# EAGLE design datalogger-v21 (EAGLE 8.0.1)
DATABASE: /Users/kina/Documents/eagle/PARTSDB.txt

## Sheet 1 of 2
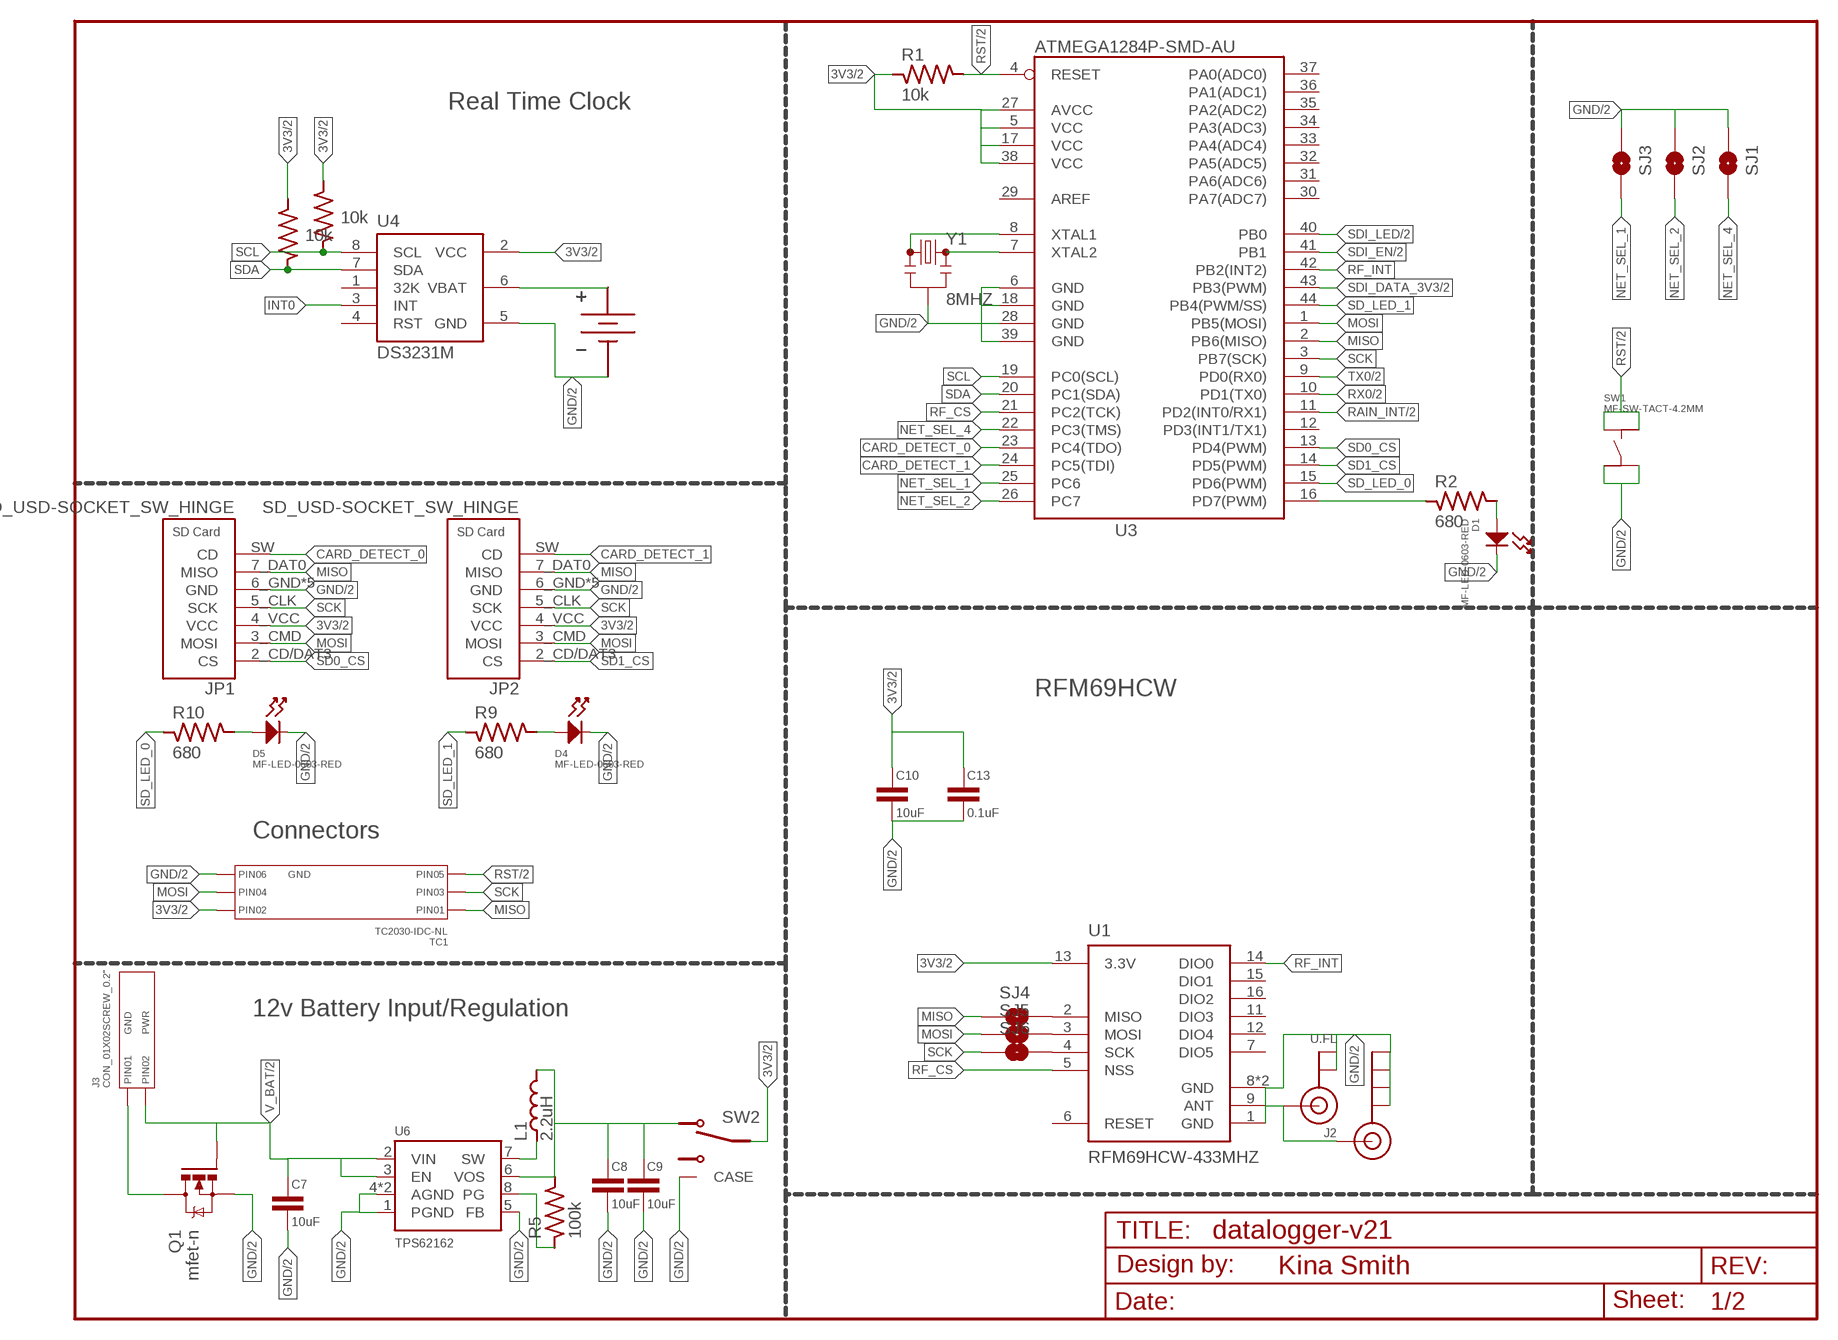
[diagram p0: schematic, sheet 1]

### Parts
BAT1  BATTERY_HOLDER12MM  [BAT_12MM]
C7  10uF  CAPACITOR_NP0805-N  [C0805-N]
C8  10uF  CAPACITOR_NP0805-N  [C0805-N]
C9  10uF  CAPACITOR_NP0805-N  [C0805-N]
C10  10uF  CAPACITOR_NP0805-N  [C0805-N]
C13  0.1uF  CAPACITOR_NP0603-N  [C0603-N]
D1  MF-LED-0603-RED  LED_SINGLE-0603-RED  [LED0603]
D4  MF-LED-0603-RED  LED_SINGLE-0603-RED  [LED0603]
D5  MF-LED-0603-RED  LED_SINGLE-0603-RED  [LED0603]
FRAME1  FRAME-LETTERNO_PACKAGE  [DUMMY]
J2  U.FL  ANTENNA_U.FL  [ADAFRUIT_U.FL]
J3  CON_01X02SCREW_0.2"  [SCREW_TERM_2POS]
J4  ANTENNA_SMA_EDGE  [SMA-EDGE]
JP1  SD_USD-SOCKET_SW_HINGE  [SD_MICRO_HIROSE-DM3C]
JP2  SD_USD-SOCKET_SW_HINGE  [SD_MICRO_HIROSE-DM3C]
L1  2.2uH  INDUCTOR2520  [L2520]
Q1  mfet-n  MOSFET-NCHANNELSOT23-3  [SOT23-3]
R1  10k  RESISTOR0603-N  [R0603-N]
R2  680  RESISTOR0603-N  [R0603-N]
R3  10k  RESISTOR0603-N  [R0603-N]
R4  10k  RESISTOR0603-N  [R0603-N]
R5  100k  RESISTOR0603-N  [R0603-N]
R9  680  RESISTOR0603-N  [R0603-N]
R10  680  RESISTOR0603-N  [R0603-N]
SJ1  JUMPER-PAD-2-NOYES_SILK  [PAD-JUMPER-2-NO_YES_SILK]
SJ2  JUMPER-PAD-2-NOYES_SILK  [PAD-JUMPER-2-NO_YES_SILK]
SJ3  JUMPER-PAD-2-NOYES_SILK  [PAD-JUMPER-2-NO_YES_SILK]
SJ4  JUMPER-PAD-2-NOYES_SILK  [PAD-JUMPER-2-NO_YES_SILK]
SJ5  JUMPER-PAD-2-NOYES_SILK  [PAD-JUMPER-2-NO_YES_SILK]
SJ6  JUMPER-PAD-2-NOYES_SILK  [PAD-JUMPER-2-NO_YES_SILK]
SW1  MF-SW-TACT-4.2MM  TACT_4.2MM  [TACT4.2MM]
SW2  SWITCH_SPDT_SMD_ES01MSABE  [SPDT_ES01MSABE]
TC1  TC2030-IDC-NL  CON_02X03_AVRISP_TC2030-IDC-NL  [TC2030-IDC-NL]
U1  RFM69HCW-433MHZ  [RFM69HCW-XXXS2]
U3  ATMEGA1284P-SMD-AU  [TQFP44]
U4  DS3231M  [SO08]
U6  TPS62162  [WSON-8]
Y1  8MHZ  RESONATOR8MHZ  [RESONATOR-SMD]

### Nets
3V3: C10.1 C13.1 JP1.4_VCC(VCC) JP2.4_VCC(VCC) R1.1 R3.2 R4.2 SW2.2(COM) TC1.P$2(PIN2) U1.13(3.3V) U3.5(VCC) U3.17(VCC) U3.27(AVCC) U3.38(VCC) U4.2(VCC) ; also sheet 2
3V3_PRE: C8.1 C9.1 L1.P$2 R5.2 SW2.1 U6.6(VOS) ; also sheet 2
ANT: J2.3(SIGNAL) J4.SIG(SIGNAL) U1.9(ANT)
CARD_DETECT_0: JP1.SW(CD) U3.23(PC4(TDO))
CARD_DETECT_1: JP2.SW(CD) U3.24(PC5(TDI))
GND [power]: BAT1.GND C7.2 C8.2 C9.2 C10.2 C13.2 D1.CATHODE D4.CATHODE D5.CATHODE J2.1(GND) J2.2(GND) J4.GND@0(GND) J4.GND@1(GND) J4.GND@2(GND) J4.GND@3(GND) JP1.6_GND(GND) JP1.GND1(GND) JP1.GND2(GND) JP1.GND3(GND) JP1.GND4(GND) JP2.6_GND(GND) JP2.GND1(GND) JP2.GND2(GND) JP2.GND3(GND) JP2.GND4(GND) Q1.2(S) SJ1.1 SJ2.1 SJ3.1 SW1.P$3 SW1.P$4 SW2.GND1(CASE) SW2.GND(CASE) TC1.P$6(PIN6) U1.1(GND) U1.8(GND) U1.10(GND) U3.6(GND) U3.18(GND) U3.28(GND) U3.39(GND) U4.5(GND) U6.1(PGND) U6.4(AGND) U6.5(FB) U6.P$9(AGND) Y1.2 ; also sheet 2
INT0: U4.3(INT)
MISO: JP1.7_DAT0(MISO) JP2.7_DAT0(MISO) SJ4.1 TC1.P$1(PIN1) U3.2(PB6(MISO))
MOSI: JP1.3_CMD(MOSI) JP2.3_CMD(MOSI) SJ5.1 TC1.P$4(PIN4) U3.1(PB5(MOSI))
N$1: J3.GND(PIN1) Q1.3(D)
N$2: R2.1 U3.16(PD7(PWM))
N$3: U3.7(XTAL2) Y1.3
N$4: D4.ANODE R9.2
N$5: U3.8(XTAL1) Y1.1
N$6: L1.P$1 U6.7(SW)
N$7: SJ4.2 U1.2(MISO)
N$8: D1.ANODE R2.2
N$9: SJ5.2 U1.3(MOSI)
N$10: BAT1.PWR@1(VBAT) BAT1.PWR@2(VBAT) U4.6(VBAT)
N$14: R5.1 U6.8(PG)
N$15: SJ6.2 U1.4(SCK)
N$20: D5.ANODE R10.2
NET_SEL_1: SJ3.2 U3.25(PC6)
NET_SEL_2: SJ2.2 U3.26(PC7)
NET_SEL_4: SJ1.2 U3.22(PC3(TMS))
RAIN_INT: U3.11(PD2(INT0/RX1)) ; also sheet 2
RF_CS: U1.5(NSS) U3.21(PC2(TCK))
RF_INT: U1.14(DIO0) U3.42(PB2(INT2))
RST: R1.2 SW1.P$1 SW1.P$2 TC1.P$5(PIN5) U3.4(RESET) ; also sheet 2
RX0: U3.10(PD1(TX0)) ; also sheet 2
SCK: JP1.5_CLK(SCK) JP2.5_CLK(SCK) SJ6.1 TC1.P$3(PIN3) U3.3(PB7(SCK))
SCL: R3.1 U3.19(PC0(SCL)) U4.8(SCL)
SD0_CS: JP1.2_CD/DAT3(CS) U3.13(PD4(PWM))
SD1_CS: JP2.2_CD/DAT3(CS) U3.14(PD5(PWM))
SD_LED_0: R10.1 U3.15(PD6(PWM))
SD_LED_1: R9.1 U3.44(PB4(PWM/SS))
SDA: R4.1 U3.20(PC1(SDA)) U4.7(SDA)
SDI_DATA_3V3: U3.43(PB3(PWM)) ; also sheet 2
SDI_EN: U3.41(PB1) ; also sheet 2
SDI_LED: U3.40(PB0) ; also sheet 2
TX0: U3.9(PD0(RX0)) ; also sheet 2
V_BAT: C7.1 J3.PWR(PIN2) Q1.1(G) U6.2(VIN) U6.3(EN) ; also sheet 2
Unconnected: SW2.3 U1.6(RESET) U1.7(DIO5) U1.11(DIO3) U1.12(DIO4) U1.15(DIO1) U1.16(DIO2) U3.12(PD3(INT1/TX1)) U3.29(AREF) U3.30(PA7(ADC7)) U3.31(PA6(ADC6)) U3.32(PA5(ADC5)) U3.33(PA4(ADC4)) U3.34(PA3(ADC3)) U3.35(PA2(ADC2)) U3.36(PA1(ADC1)) U3.37(PA0(ADC0)) U4.1(32K) U4.4(RST)

### Notes on the sheet
- Real Time Clock
- RFM69HCW
- Connectors
- 12v Battery Input/Regulation

## Sheet 2 of 2
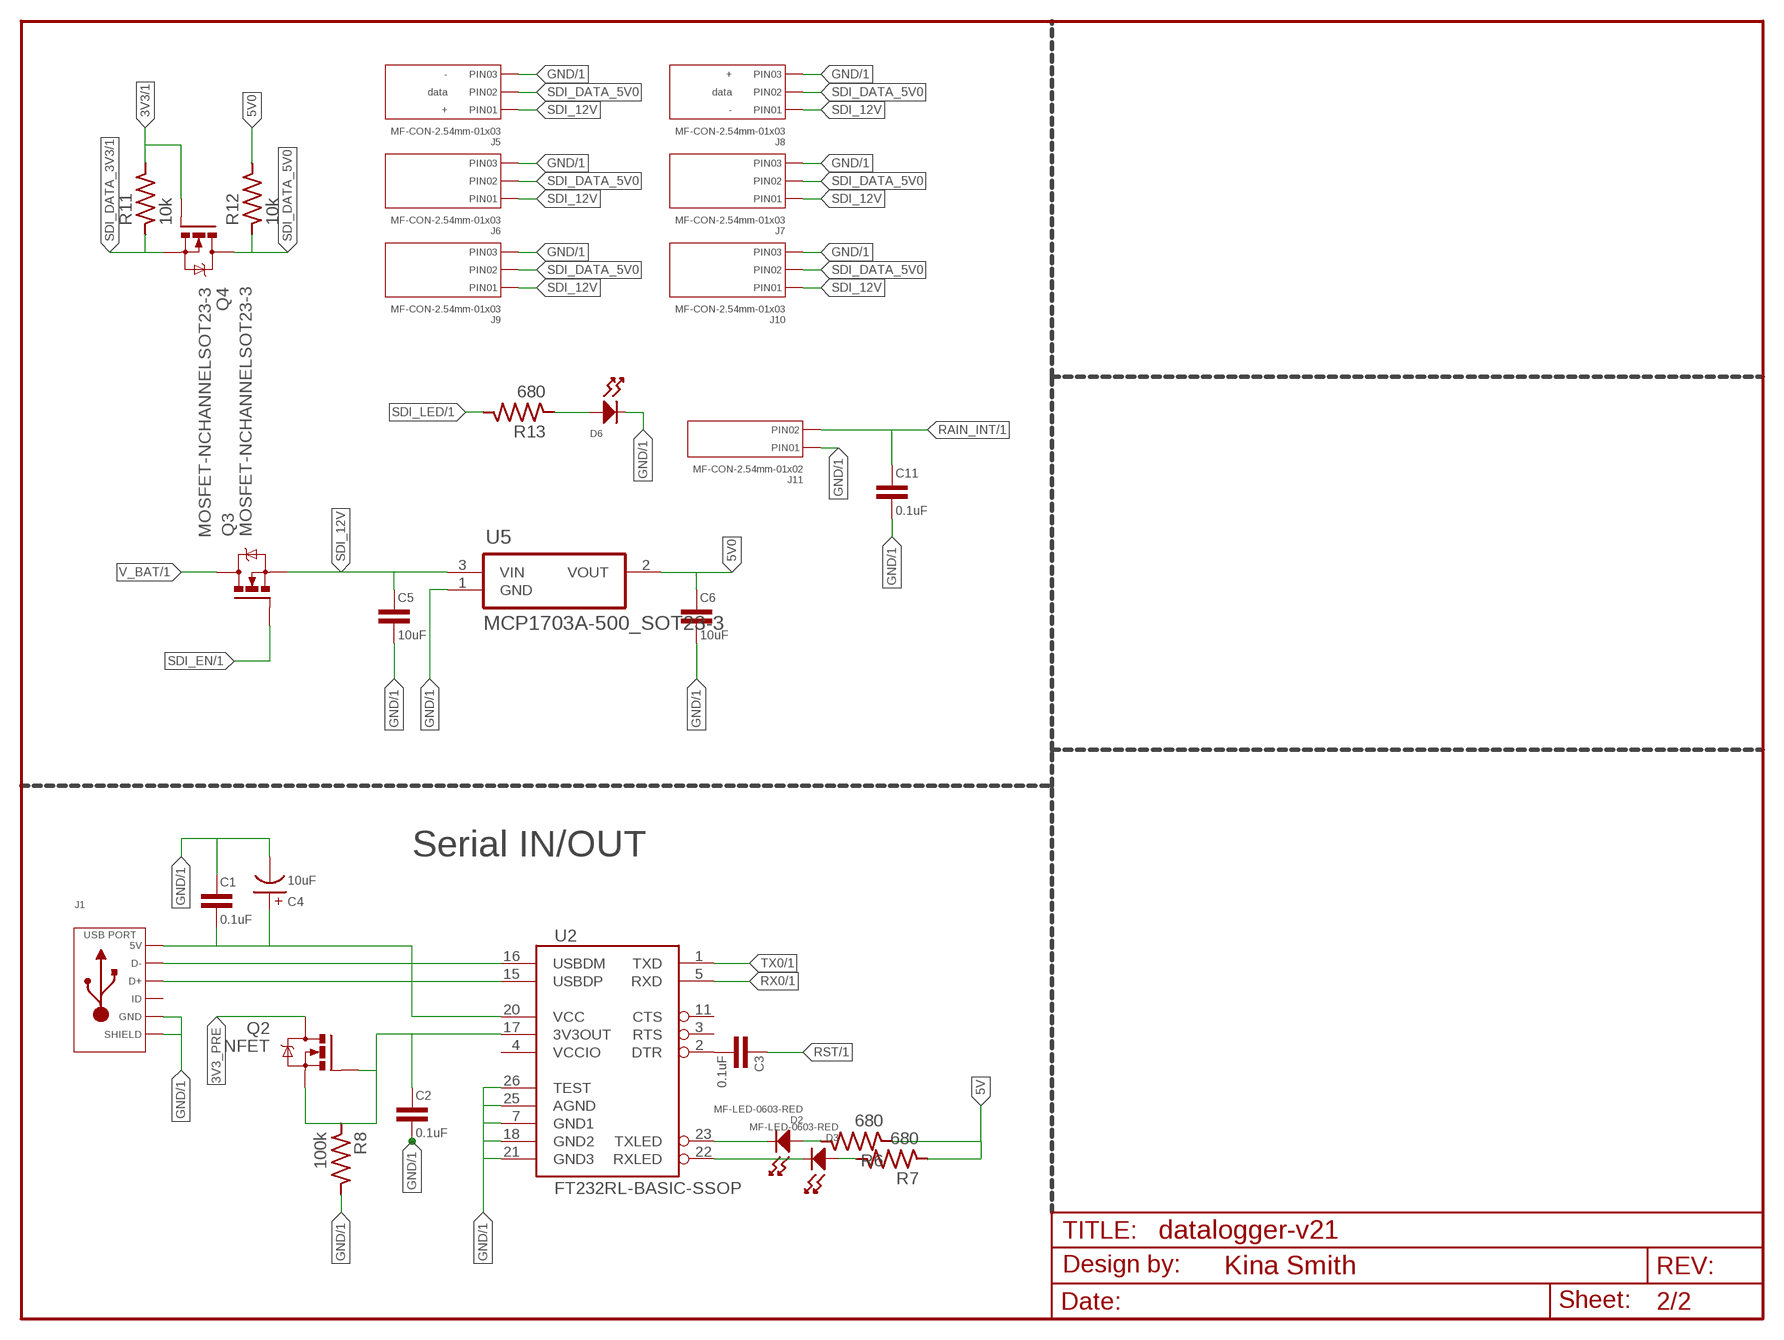
[diagram p1: schematic, sheet 2]

### Parts
C1  0.1uF  CAPACITOR_NP0603-N  [C0603-N]
C2  0.1uF  CAPACITOR_NP0603-N  [C0603-N]
C3  0.1uF  CAPACITOR_NP0603-N  [C0603-N]
C4  10uF  CAPACITOR_P_3216  [EIA3216]
C5  10uF  CAPACITOR_NP0805-N  [C0805-N]
C6  10uF  CAPACITOR_NP0805-N  [C0805-N]
C11  0.1uF  CAPACITOR_NP0603-N  [C0603-N]
D2  MF-LED-0603-RED  LED_SINGLE-0603-RED  [LED0603]
D3  MF-LED-0603-RED  LED_SINGLE-0603-RED  [LED0603]
D6  LED_SINGLE-0603  [LED0603]
FRAME3  FRAME-LETTERNO_PACKAGE  [DUMMY]
J1  USB-5PIN_B-MICRO_R/A_STRONG  [USB-MICRO-MOLEX-105017-0001]
J5  MF-CON-2.54mm-01x03  CON_01X03_PTH_2.54MM  [PTH_2.54MM_01X03]
J6  MF-CON-2.54mm-01x03  CON_01X03_PTH_2.54MM  [PTH_2.54MM_01X03]
J7  MF-CON-2.54mm-01x03  CON_01X03_PTH_2.54MM  [PTH_2.54MM_01X03]
J8  MF-CON-2.54mm-01x03  CON_01X03_PTH_2.54MM  [PTH_2.54MM_01X03]
J9  MF-CON-2.54mm-01x03  CON_01X03_PTH_2.54MM  [PTH_2.54MM_01X03]
J10  MF-CON-2.54mm-01x03  CON_01X03_PTH_2.54MM  [PTH_2.54MM_01X03]
J11  MF-CON-2.54mm-01x02  CON_01X02_PTH_2.54MM  [PTH_2.54MM_01X02]
Q2  NFET  MOSFET-NCHANNELSOT23-3  [SOT23-3]
Q3  MOSFET-NCHANNELSOT23-3  [SOT23-3]
Q4  MOSFET-NCHANNELSOT23-3  [SOT23-3]
R6  680  RESISTOR0603-N  [R0603-N]
R7  680  RESISTOR0603-N  [R0603-N]
R8  100k  RESISTOR0603-N  [R0603-N]
R11  10k  RESISTOR0603-N  [R0603-N]
R12  10k  RESISTOR0603-N  [R0603-N]
R13  680  RESISTOR0603-N  [R0603-N]
U2  FT232RL-BASIC-SSOP  [SSOP28]
U5  MCP1703A-500_SOT23-3  [SOT23-3]

### Nets
3V3: Q4.1(G) R11.2 ; also sheet 1
3V3_PRE: Q2.3(D) ; also sheet 1
5V [power]: C1.2 C4.A(POS) J1.1(5V) R6.1 R7.1 U2.20(VCC)
5V0: C6.1 R12.2 U5.2(VOUT)
GND [power]: C1.1 C2.2 C4.C(NEG) C5.2 C6.2 C11.2 D6.CATHODE J1.5(GND) J1.P$1(SLD) J1.P$2(SLD) J1.P$3(SLD) J1.P$4(SLD) J1.P$5(SLD) J1.P$6(SLD) J5.P$3(PIN3) J6.P$3(PIN3) J7.P$3(PIN3) J8.P$3(PIN3) J9.P$3(PIN3) J10.P$3(PIN3) J11.P$1(PIN1) R8.2 U2.7(GND1) U2.18(GND2) U2.21(GND3) U2.25(AGND) U2.26(TEST) U5.1(GND) ; also sheet 1
N$11: J1.2(D-) U2.16(USBDM)
N$12: J1.3(D+) U2.15(USBDP)
N$13: D6.ANODE R13.1
N$23: C2.1 Q2.1(G) Q2.2(S) R8.1 U2.17(3V3OUT)
N$29: C3.2 U2.2(DTR)
N$30: D2.CATHODE U2.23(TXLED)
N$31: D3.CATHODE U2.22(RXLED)
N$32: D3.ANODE R7.2
N$33: D2.ANODE R6.2
RAIN_INT: C11.1 J11.P$2(PIN2) ; also sheet 1
RST: C3.1 ; also sheet 1
RX0: U2.5(RXD) ; also sheet 1
SDI_12V: C5.1 J5.P$1(PIN1) J6.P$1(PIN1) J7.P$1(PIN1) J8.P$1(PIN1) J9.P$1(PIN1) J10.P$1(PIN1) Q3.2(S) U5.3(VIN)
SDI_DATA_3V3: Q4.2(S) R11.1 ; also sheet 1
SDI_DATA_5V0: J5.P$2(PIN2) J6.P$2(PIN2) J7.P$2(PIN2) J8.P$2(PIN2) J9.P$2(PIN2) J10.P$2(PIN2) Q4.3(D) R12.1
SDI_EN: Q3.1(G) ; also sheet 1
SDI_LED: R13.2 ; also sheet 1
TX0: U2.1(TXD) ; also sheet 1
V_BAT: Q3.3(D) ; also sheet 1
Unconnected: J1.4(ID) U2.3(RTS) U2.11(CTS)

### Notes on the sheet
- Serial IN/OUT

## Power pins joined to a net without a drawn wire
VCCIO: U2.4(VCCIO)

## Library data of the parts
BAT1 = My_Connectors:BATTERY_HOLDER; PARTNO: BK-885-TR
C1-C3 C5 C6 C11 = My_Passives:CAPACITOR_NP
C4 = My_Passives:CAPACITOR_P: Library: MF_Passives Description: Device for Polarized Capacitors. Manufacture part number (MPN), Voltage Rating, and Tolerance can be added via Attributes. Check https://factory.macrofab.com/parts for the house parts list.
C7-C10 = My_Passives:CAPACITOR_NP; PARTNO: GRM21BR61C106KE15L
C13 = My_Passives:CAPACITOR_NP; PARTNO: CC0603KRX7R7BB104
D1-D5 = My_LEDs:LED_SINGLE: Library: MF_LEDs Description: Device for Single LED Packages. Manufacture part number (MFG#) can be added via Attributes.; HOUSEPART: YES; MPN: MF-LED-0603-RED; POPULATE: 1; URL: https://factory.macrofab.com/part/MF-LED-0603-RED
D6 = My_LEDs:LED_SINGLE: Library: MF_LEDs Description: Device for Single LED Packages. Manufacture part number (MFG#) can be added via Attributes.; HOUSEPART: NO; POPULATE: 1
FRAME1 FRAME3 = _my-parts:FRAME-LETTER: Schematic Frame Standard 8.5x11 US Letter frame; DESIGNER: Nobody; VERSION: v01
J1 = My_Connectors:USB-5PIN: Library: MF_Connectors Description: 5 Pin USB Connectors. SLD is the shield connection. Usually tied to ground through a small ferrite bead.; PARTNO: 1050170001
J2 = My_Connectors:ANTENNA_U.FL: U.FL Antenna Connector; PARTNO: U.FL-R-SMT-1(10)
J3 = My_Connectors:CON_01X02: Library: MF_Connectors Description: Header Connector with 02 Positions and 01 Rows. Use the LABEL Attribute to label the pin on the schematic and PCB. You can remove the attributes on the PCB by using the SMASH function on the part and then deleting the text.; LABEL01: GND; LABEL02: PWR; PARTNO: 1729128
J4 = My_Connectors:ANTENNA_SMA_EDGE: SMA Antenna Connector End launch SMA connector. The paste layer has been removed so that the connector can be hand soldered onto the board after reflow.; PARTNO: EMPCB.SMAFSTJ.B.HT
J5 = My_Connectors:CON_01X03: Library: MF_Connectors Description: Header Connector with 03 Positions and 01 Rows. Use the LABEL Attribute to label the pin on the schematic and PCB. You can remove the attributes on the PCB by using the SMASH function on the part and then deleting the text.; HOUSEPART: YES; LABEL01: +; LABEL02: data; LABEL03: -; MPN: MF-CON-2.54mm-01x03; POPULATE: 1; URL: https://factory.macrofab.com/part/MF-CON-2.54mm-01x03
J6 J7 J9 J10 = My_Connectors:CON_01X03: Library: MF_Connectors Description: Header Connector with 03 Positions and 01 Rows. Use the LABEL Attribute to label the pin on the schematic and PCB. You can remove the attributes on the PCB by using the SMASH function on the part and then deleting the text.; HOUSEPART: YES; MPN: MF-CON-2.54mm-01x03; POPULATE: 1; URL: https://factory.macrofab.com/part/MF-CON-2.54mm-01x03
J8 = My_Connectors:CON_01X03: Library: MF_Connectors Description: Header Connector with 03 Positions and 01 Rows. Use the LABEL Attribute to label the pin on the schematic and PCB. You can remove the attributes on the PCB by using the SMASH function on the part and then deleting the text.; HOUSEPART: YES; LABEL01: -; LABEL02: data; LABEL03: +; MPN: MF-CON-2.54mm-01x03; POPULATE: 1; URL: https://factory.macrofab.com/part/MF-CON-2.54mm-01x03
J11 = My_Connectors:CON_01X02: Library: MF_Connectors Description: Header Connector with 02 Positions and 01 Rows. Use the LABEL Attribute to label the pin on the schematic and PCB. You can remove the attributes on the PCB by using the SMASH function on the part and then deleting the text.; HOUSEPART: YES; MPN: MF-CON-2.54mm-01x02; POPULATE: 1; URL: https://factory.macrofab.com/part/MF-CON-2.54mm-01x02
JP1 JP2 = My_Connectors:SD_USD-SOCKET_SW: microSD Socket Push-push type uSD socket with full SDIO signal mapping. Spark Fun Electronics SKU : PRT-00127. tDoc lines correctly indicate media card edge positions when inserting (unlocked, locked, depressed). NOTE: CD1 and CD2 are connected internally, and short to ground when card is removed.; PARTNO: DM3CS-SF
L1 = My_Passives:INDUCTOR; PARTNO: VLS252012T-2R2M1R3
Q1 = My_Descrete_Semiconductors:MOSFET-NCHANNEL: Common NMOSFET Parts MFG P/N Store ID Prod ID FDD8780 TRANS-09984 SI7820DN TRANS-11055 FDS6630A IC-08089 2N7002PW TRANS-11151 FQP30N06L COM-10213 TRANS-10060 BSS123LT1G TRANS-08345 BSS138 TRANS-00830 BS170 2N7000; PARTNO: SI2312BDS-T1-GE3
Q2-Q4 = My_Descrete_Semiconductors:MOSFET-NCHANNEL: Common NMOSFET Parts MFG P/N Store ID Prod ID FDD8780 TRANS-09984 SI7820DN TRANS-11055 FDS6630A IC-08089 2N7002PW TRANS-11151 FQP30N06L COM-10213 TRANS-10060 BSS123LT1G TRANS-08345 BSS138 TRANS-00830 BS170 2N7000
R1-R4 R9 R10 = My_Passives:RESISTOR; PARTNO: RC0603FR-0710KL
R5 = My_Passives:RESISTOR; PARTNO: RC0603FR-07100KL
R6-R8 R11-R13 = My_Passives:RESISTOR
SJ1-SJ6 = My_Passives:JUMPER-PAD-2-NO; PARTNO: NA
SW1 = My_ElectroMechanical:TACT: Library: MF_Switches Description: Device for Tact Switches. Manufacture part number (MFG#) can be added via Attributes.; HOUSEPART: YES; MPN: MF-SW-TACT-4.2MM; PARTNO: PTS810 SJM 250 SMTR LFS; POPULATE: 1; URL: https://factory.macrofab.com/part/MF-SW-TACT-4.2MM
SW2 = My_ElectroMechanical:SWITCH_SPDT; PARTNO: ES01MSABE
TC1 = My_Connectors:CON_02X03: Library: MF_Connectors Description: Header Connector with 6 Positions and 02 Rows. Use the LABEL Attribute to label the pin on the schematic and PCB. You can remove the attributes on the PCB by using the SMASH function on the part and then deleting the text.; HOUSEPART: NO; LABEL06: GND; MPN: TC2030-IDC-NL; PARTNO: NA; POPULATE: 0; URL: http://www.tag-connect.com/AVRISP
U1 = My_RF:RFM69H; PARTNO: COM-13910; PROD_ID: IC-11997, IC-12053
U2 = My_IC_Digital:FT232RL-BASIC: USB UART This is the simplified version of the FT232RL unit. Only what you need, nothing you don't. Spark Fun Electronics SKU : COM-00650
U3 = My_IC_Digital:ATMEGA1284P-SMD
U4 = My_IC_Digital:DS3231M: The DS3231M is a low-cost extremely accurate I2C realtime clock (RTC). Datasheet <https://datasheets.maximintegrated.com/en/ds/DS3231M.pdf>; PARTNO: DS3231MZ/V+
U5 = My_IC_Power:MCP1703A: 250 mA, 16V, Low Quiescent Current LDO Regulator Source: http://ww1.microchip.com/downloads/en/DeviceDoc/22049b.pdf; PARTNO: MCP1703AT-5002E/CB
U6 = My_IC_Power:TPS62162; PARTNO: TPS62162DSGR
Y1 = My_xTal:RESONATOR: Resonator Small SMD resonator. Used, eg, on the Arduino Pro/ Pro Mini boards. 8MHz- XTAL-08895 16MHz- XTAL-08900; PARTNO: CSTCE8M00G55-R0; PROD_ID: XTAL-08895

## Net classes
1 power: width 0.381 mm, clearance 0.254 mm

## Board
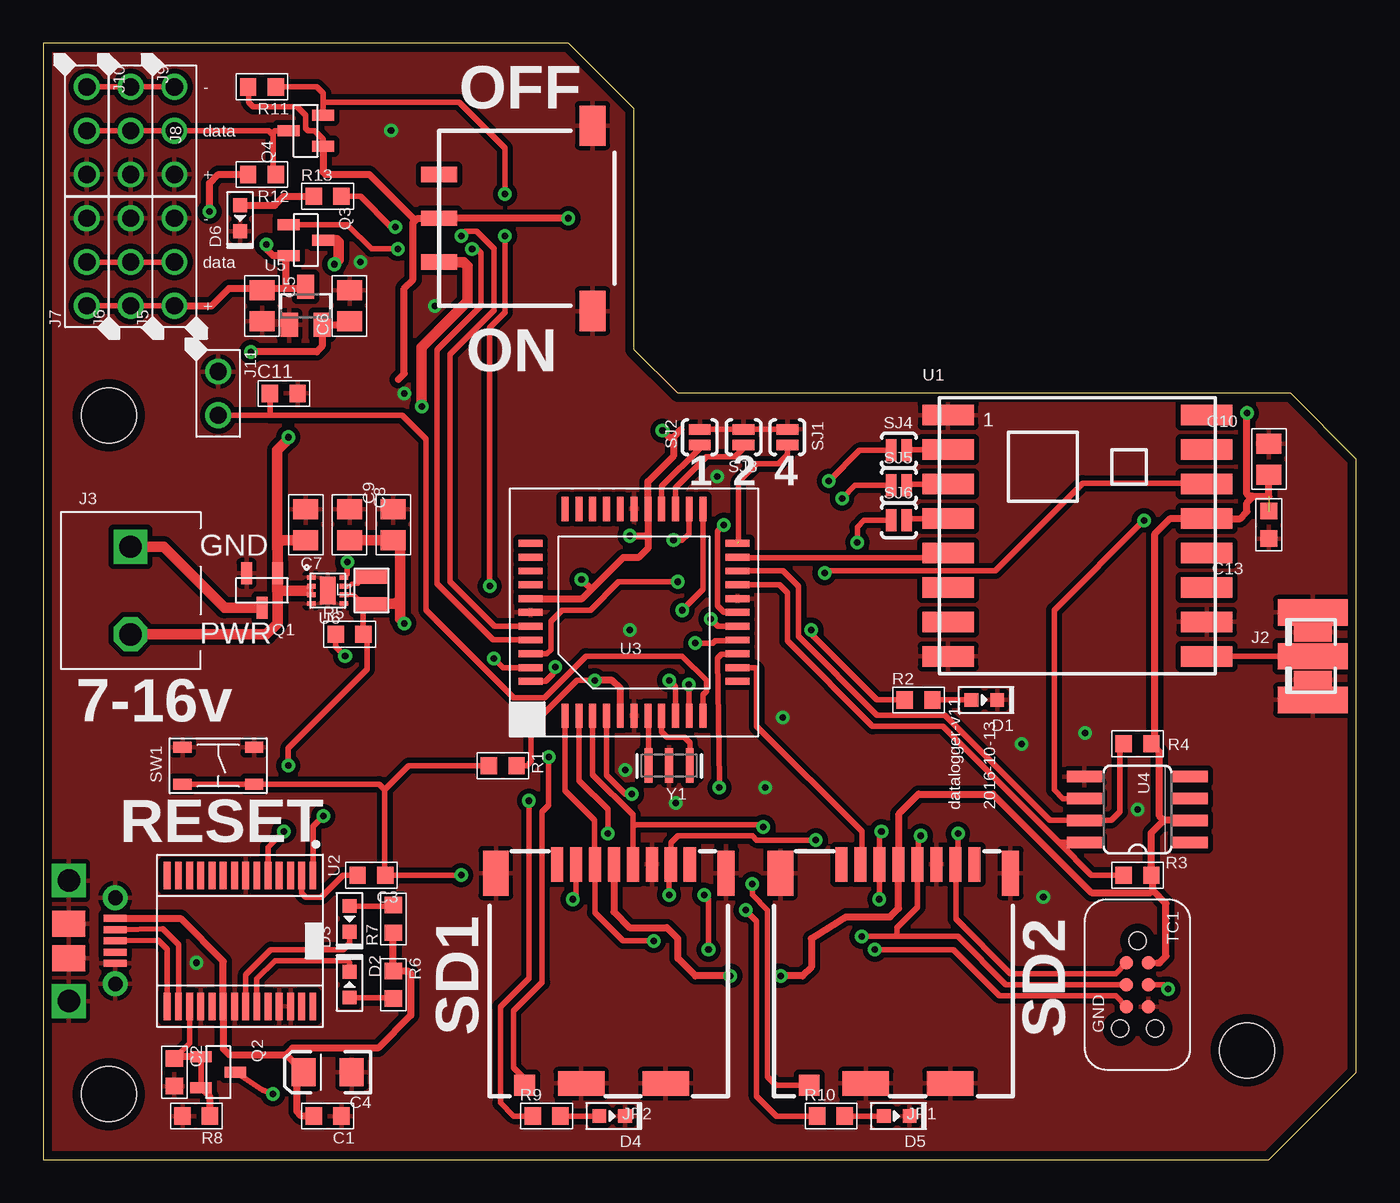
[diagram p2: board, top side]
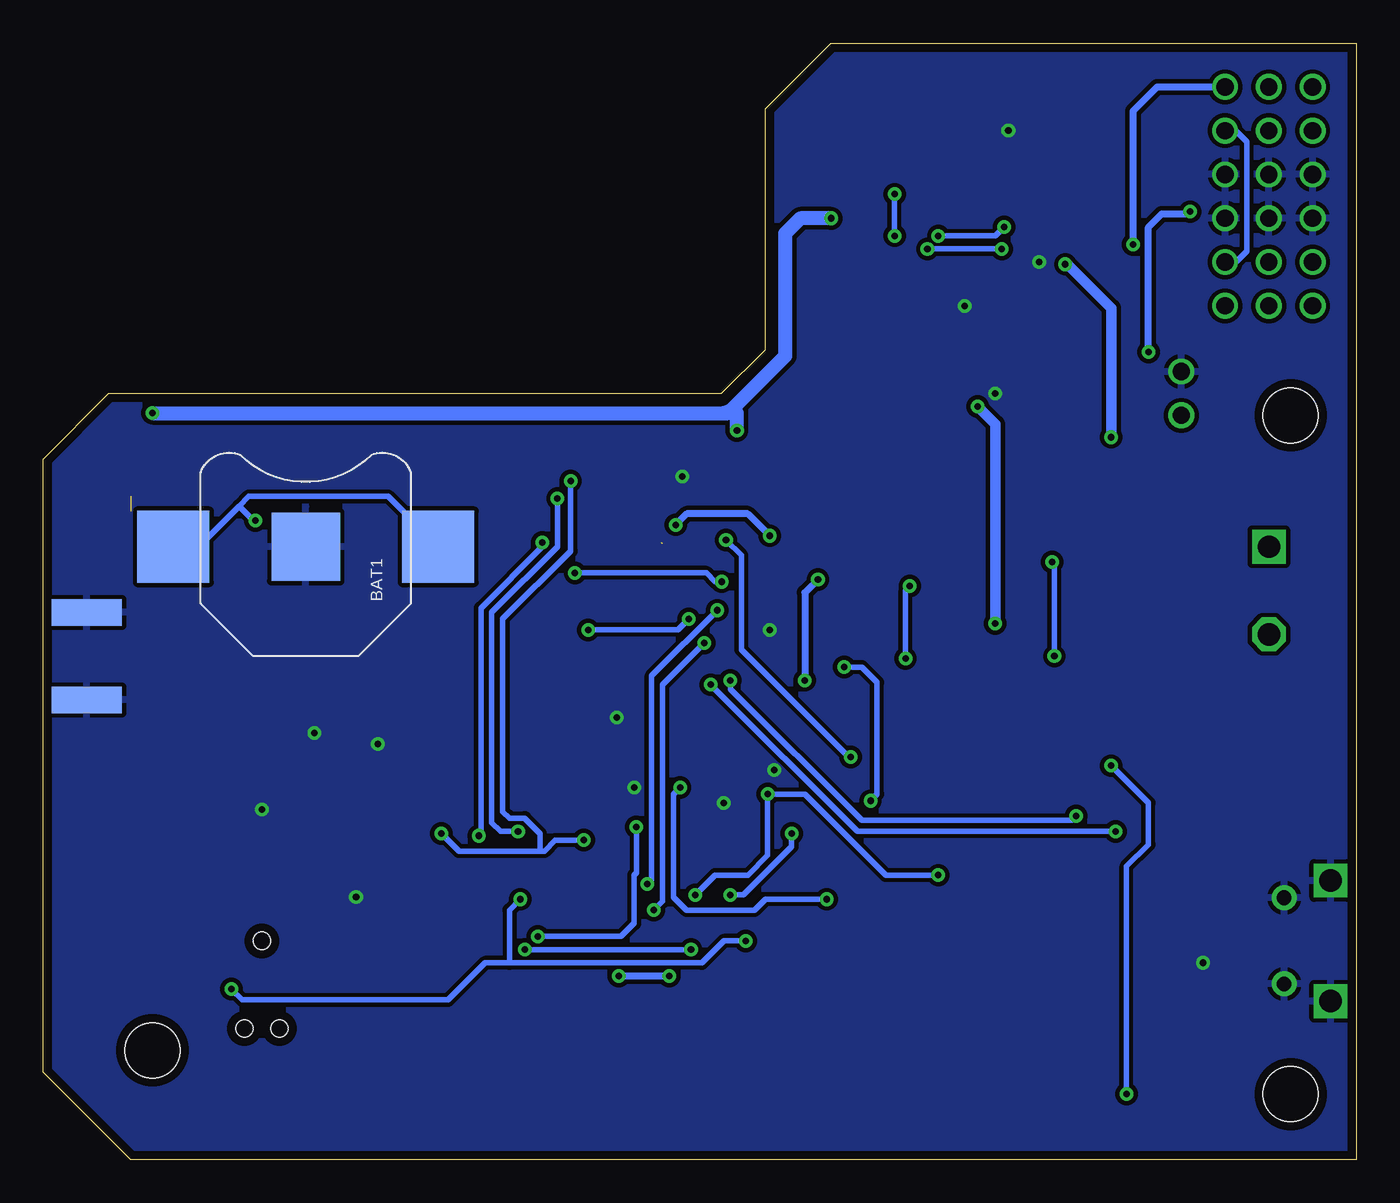
[diagram p3: board, bottom side, seen from below]

Size 76.2 x 64.77 mm. Coordinates in mm from the lower left corner, seen from the top.
Outline: 0,0 71.12,0 76.2,5.08 76.2,40.64 72.39,44.45 36.83,44.45 34.29,46.99 34.29,60.96 30.48,64.77 0,64.77 0,0
Copper layers (1*16): Top 0.0178mm / dielectric 59mil / Bottom 0.0178mm
Design rules "SSC-EAGLE-2Lyr_v1.0.0.3 *": minimum track width 6mil, minimum drill 14mil, track to track 6mil, track to pad 6mil, pad to pad 6mil, via to via 6mil, smd to smd 6mil, copper to edge 20mil, drill to drill 16mil, minimum pad ring 8mil, minimum via ring 8mil, stop-mask expansion 3mil, vias tented up to drill 0mil, thermal gap 10mil
Holes 3.17 mm at 3.81,43.18 69.85,6.35 3.81,3.81

### Footprints (pad centres in the part's own frame; a part is rotated, then mirrored left to right if it is on the bottom)
BAT_12MM = smd 3.962 x 3.962: GND 0,0 | smd 4.17 x 4.17: PWR@1 -7.685,0; PWR@2 7.685,0
C0603-N = smd 0.95 x 1: 1 -0.8,0; 2 0.8,0
EIA3216 = smd 1.4 x 1.6: A 1.4,0; C -1.4,0
C0805-N = smd 1.15 x 1.45: 1 -0.9,0; 2 0.9,0
LED0603 = smd 0.8 x 0.8: ANODE 0.75,0; CATHODE -0.75,0
USB-MICRO-MOLEX-105017-0001 = smd 0.4 x 1.35: 1 -1.3,0; 2 -0.65,0; 3 0,0; 4 0.65,0; 5 1.3,0 | drill 0.85 pad 1.45: P$1 -2.5,0; P$2 2.5,0 | smd 1.5 x 1.9: P$3 1,-2.7; P$4 -1,-2.7 | drill 1.3 square: P$5 -3.5,-2.7; P$6 3.5,-2.7
ADAFRUIT_U.FL = smd 2.2 x 1.05: 1 0,1.375; 2 0,-1.375 | smd 0.8 x 1: 3 1.525,0
SCREW_TERM_2POS = drill 1.3 square: GND -2.54,0 | drill 1.3 octagon: PWR 2.54,0
SMA-EDGE = smd 1.524 x 4.064: GND@0 0,0; GND@1 5.08,0; SIG 2.54,0 | smd 1.524 x 4.064 bottom: GND@2 0,0; GND@3 5.08,0
PTH_2.54MM_01X03 = drill 1: P$1 -2.54,0; P$2 0,0; P$3 2.54,0
PTH_2.54MM_01X02 = drill 1: P$1 -1.27,0; P$2 1.27,0
SD_MICRO_HIROSE-DM3C = smd 0.7 x 2: 1_DAT2 3.2,-5.7; 2_CD/DAT3 2.1,-5.7; 3_CMD 1,-5.7; 4_VCC -0.1,-5.7; 5_CLK -1.2,-5.7; 6_GND -2.3,-5.7; 7_DAT0 -3.4,-5.7; 8_DAT1 -4.5,-5.7 | smd 1 x 2.6: GND1 -6.6,-5.2 | smd 1.5 x 2.6: GND2 6.75,-5.2 | smd 2.7 x 1.4: GND3 -3.1,7; GND4 1.8,7 | smd 1.2 x 1.2: SW 5.08,7.1
L2520 = smd 0.85 x 2: P$1 -0.825,0; P$2 0.825,0
SOT23-3 = smd 0.635 x 1.27: 1 -0.9,-1; 2 0.9,-1; 3 0,1
R0603-N = smd 0.95 x 1: 1 -0.8,0; 2 0.8,0
PAD-JUMPER-2-NO_YES_SILK = smd 0.635 x 1.27: 1 -0.45,0; 2 0.45,0
TACT4.2MM = smd 1.05 x 0.65: P$1 -2.075,1.075; P$2 2.075,1.075; P$3 -2.075,-1.075; P$4 2.075,-1.075
SPDT_ES01MSABE = smd 0.889 x 2.083: 1 2.54,-8.89; 2 0,-8.89; 3 -2.54,-8.89 | smd 2.324 x 1.524: GND 5.378,0; GND1 -5.378,0
TC2030-IDC-NL = smd 0.787 x 0.787: P$1 -1.27,-0.635; P$2 -1.27,0.635; P$3 0,-0.635; P$4 0,0.635; P$5 1.27,-0.635; P$6 1.27,0.635 | hole 0.991: 2.54,1.016; 2.54,-1.016; -2.54,0
RFM69HCW-XXXS2 = smd 3 x 1.2: 1 -7.5,7; 2 -7.5,5; 3 -7.5,3; 4 -7.5,1; 5 -7.5,-1; 6 -7.5,-3; 7 -7.5,-5; 8 -7.5,-7; 9 7.5,-7; 10 7.5,-5; 11 7.5,-3; 12 7.5,-1; 13 7.5,1; 14 7.5,3; 15 7.5,5; 16 7.5,7
SSOP28 = smd 1.6 x 0.4: 1 -3.8,4.225; 2 -3.8,3.575; 3 -3.8,2.925; 4 -3.8,2.275; 5 -3.8,1.625; 6 -3.8,0.975; 7 -3.8,0.325; 8 -3.8,-0.325; 9 -3.8,-0.975; 10 -3.8,-1.625; 11 -3.8,-2.275; 12 -3.8,-2.925; 13 -3.8,-3.575; 14 -3.8,-4.225; 15 3.8,-4.225; 16 3.8,-3.575; 17 3.8,-2.925; 18 3.8,-2.275; 19 3.8,-1.625; 20 3.8,-0.975; 21 3.8,-0.325; 22 3.8,0.325; 23 3.8,0.975; 24 3.8,1.625; 25 3.8,2.275; 26 3.8,2.925; 27 3.8,3.575; 28 3.8,4.225
TQFP44 = smd 1.4 x 0.4: 1 -6,4; 2 -6,3.2; 3 -6,2.4; 4 -6,1.6; 5 -6,0.8; 6 -6,0; 7 -6,-0.8; 8 -6,-1.6; 9 -6,-2.4; 10 -6,-3.2; 11 -6,-4; 23 6,-4; 24 6,-3.2; 25 6,-2.4; 26 6,-1.6; 27 6,-0.8; 28 6,0; 29 6,0.8; 30 6,1.6; 31 6,2.4; 32 6,3.2; 33 6,4 | smd 0.4 x 1.4: 12 -4,-6; 13 -3.2,-6; 14 -2.4,-6; 15 -1.6,-6; 16 -0.8,-6; 17 0,-6; 18 0.8,-6; 19 1.6,-6; 20 2.4,-6; 21 3.2,-6; 22 4,-6; 34 4,6; 35 3.2,6; 36 2.4,6; 37 1.6,6; 38 0.8,6; 39 0,6; 40 -0.8,6; 41 -1.6,6; 42 -2.4,6; 43 -3.2,6; 44 -4,6
SO08 = smd 0.66 x 2.032: 1 -1.905,-3.073; 2 -0.635,-3.073; 3 0.635,-3.073; 4 1.905,-3.073; 5 1.905,3.073; 6 0.635,3.073; 7 -0.635,3.073; 8 -1.905,3.073
SOT23-3' = smd 1 x 1.4: 1 -0.95,-1.1; 2 0.95,-1.1; 3 0,1.1
WSON-8 = smd 0.28 x 0.5: 1 -0.75,-0.95; 2 -0.25,-0.95; 3 0.25,-0.95; 4 0.75,-0.95; 5 0.75,0.95; 6 0.25,0.95; 7 -0.25,0.95; 8 -0.75,0.95 | smd 1.6 x 0.9: P$9 0,0
RESONATOR-SMD = smd 0.45 x 2: 1 -1.2,0; 2 0,0; 3 1.2,0

### Placement (x,y rotation side)
BAT1  60.96,35.56 0 bottom
C1  16.51,2.54 180 top
C2  7.62,5.08 270 top
C3  19.05,16.51 180 top
C4  16.51,5.08 180 top
C5  12.7,49.53 270 top
C6  17.78,49.53 90 top
C7  15.24,36.83 90 top
C8  17.78,36.83 90 top
C9  20.32,36.83 90 top
C10  71.12,40.64 90 top
C11  13.97,44.45 0 top
C13  71.12,36.83 270 top
D1  54.61,26.67 180 top
D2  17.78,10.16 270 top
D3  17.78,13.97 90 top
D4  33.02,2.54 180 top
D5  49.53,2.54 180 top
D6  11.43,54.61 90 top
FRAME1  0,-1.27 0 top
FRAME3  1.27,-1.27 0 top
J1  4.19,12.7 270 top
J2  73.66,29.21 180 top
J3  5.08,33.02 270 top
J4  73.66,31.75 270 top
J5  7.62,52.07 90 top
J6  5.08,52.07 90 top
J7  2.54,52.07 90 top
J8  7.62,59.69 270 top
J9  5.08,59.69 270 top
J10  2.54,59.69 270 top
J11  10.16,44.45 270 top
JP1  49.53,11.43 180 top
JP2  33.02,11.43 180 top
L1  19.05,33.02 270 top
Q1  12.7,33.02 180 top
Q2  10.16,5.08 270 top
Q3  15.24,53.34 270 top
Q4  15.24,59.69 90 top
R1  26.67,22.86 180 top
R2  50.8,26.67 0 top
R3  63.5,16.51 0 top
R4  63.5,24.13 0 top
R5  17.78,30.48 0 top
R6  20.32,10.16 270 top
R7  20.32,13.97 90 top
R8  8.89,2.54 180 top
R9  29.21,2.54 0 top
R10  45.72,2.54 0 top
R11  12.7,62.23 180 top
R12  12.7,57.15 180 top
R13  16.51,55.88 0 top
SJ1  43.18,41.91 270 top
SJ2  38.1,41.91 270 top
SJ3  40.64,41.91 270 top
SJ4  49.66,41.15 0 top
SJ5  49.66,39.12 0 top
SJ6  49.66,37.08 0 top
SW1  10.16,22.86 180 top
SW2  31.88,54.61 270 top
TC1  63.5,10.16 270 top
U1  60.01,36.2 0 top
U2  11.43,12.7 270 top
U3  34.29,31.75 90 top
U4  63.5,20.32 90 top
U5  MCP1703A-500_SOT23-3  [SOT23-3']  15.24,49.53 0 top
U6  16.51,33.02 270 top
Y1  36.32,22.86 180 top

### Tracks (layer width: path | path; a pad name or v marks a point on that pad's centre or on a via)
3V3  (via drill 0.38)  (1 unrouted)
  Top 0.305: 64.52,23.91 R4.2 64.52,24.35 | U3.17 39.5,31.75 39.12,32.13 39.12,36.45 v39.5,36.83 | 64.26,16.47 R3.2 | TC1.P$2 64.64,11.43 | Q4.1 16.24,59.2 15.75,59.69 15.37,59.69 15.24,59.82 15.24,60.58 14.73,61.09 12.19,61.09 11.94,61.34 11.94,62.19 R11.2 | v32,27.81 30.99,27.81 28.32,25.15 28.32,23.11 28.07,22.86 R1.1
  Top 0.406: 21.59,54.48 21.46,54.36 21.46,51.05 20.95,50.55 20.95,45.59 20.61,45.25 | 21.59,54.48 21.72,54.61 SW2.2 v30.48,54.61 | Q4.1 16.24,57.29 16.38,57.15 18.92,57.15 21.59,54.48 | 37.03,42.36 36.58,41.91 | 36.58,41.91 36.58,40.82 35.09,39.33 U3.27 35.09,36.32 | U3.38 31.28,32.55 31.81,33.08 | 31.81,33.08 33.66,34.92 34.54,34.92 35.09,35.47 35.09,36.32 | v34.04,36.2 34.96,36.2 35.09,36.32 | v31.24,33.66 31.81,33.08 | U3.5 33.49,27.34 33.02,27.81 v32,27.81 | JP2.4_VCC 33.12,14.38 34.04,13.46 36.2,13.46 36.83,12.83 36.83,11.68 37.85,10.67 v39.88,10.67 | 64.39,15.62 64.26,15.49 60.83,15.49 55.12,21.21 50.8,21.21 49.66,20.07 49.66,17.1 JP1.4_VCC 49.63,14.58 49.15,14.1 46.61,14.1 44.58,12.83 44.58,11.18 44.07,10.67 v42.8,10.67 | 64.39,15.62 64.39,16.42 R3.2 64.3,18.96 65.02,19.68 | 64.64,11.43 64.77,11.43 65.15,11.81 65.15,14.86 64.39,15.62 | U4.2 65.02,19.68 | 65.02,19.68 64.77,19.94 64.77,23.66 R4.2 | 64.52,24.35 64.52,36.32 65.41,37.21 67.49,37.21 U1.13 69.45,37.2 69.85,37.59 69.85,38.1 70.23,38.48 | 70.23,38.48 71.12,38.48 C10.1 | 70.23,38.48 69.98,38.48 69.85,38.61 v69.85,43.31 69.85,43.56 | v35.94,42.29 36.32,41.91 36.58,41.91
  Bottom 0.406: v34.04,36.2 35.31,37.47 38.86,37.47 v39.5,36.83 | 36.32,43.69 36.45,43.31 | v42.8,10.67 v39.88,10.67 | v31.24,33.66 32,32.89 v32,27.81
  Bottom 0.813: v69.85,43.31 36.7,43.31 | 36.7,43.31 36.45,43.31 36.2,43.56 | 36.2,43.56 33.15,46.61 33.15,53.72 32.26,54.61 v30.48,54.61 | 36.32,43.43 36.7,43.31 | v35.94,42.29 35.94,43.31 36.2,43.56
3V3_PRE  (via drill 0.38)
  Top 0.254: U6.6 18.03,32.77 18.41,32.38 18.86,32.38 L1.P$2
  Top 0.305: Q2.3 12.7,4.06 v13.34,3.81 | v14.22,22.86 14.22,23.88 18.8,28.45 18.8,30.26 R5.2 18.58,31.73 L1.P$2
  Top 0.406: C8.1 C9.1
  Top 0.61: C8.1 20.44,35.93 20.45,35.94 20.7,35.94 20.7,32.51 | 20.7,32.51 20.45,32.26 19.11,32.26 L1.P$2 | 20.7,32.51 20.7,31.37 v20.95,31.11 | v21.97,43.69 21.97,47.12 24.64,49.78 24.64,51.82 24.38,52.07 SW2.1
  Bottom 0.305: v13.34,3.81 13.34,17.02 12.06,18.29 12.06,20.7 v14.22,22.86
  Bottom 0.61: v20.95,31.11 20.95,42.67 v21.97,43.69
5V
  Top 0.406: J1.1 7.97,14 10.46,11.52 U2.20 10.46,6.44 10.79,6.1 14.09,6.1 | R7.1 R6.1 21.17,10.96 21.34,10.79 21.34,8.38 19.43,6.48 14.47,6.48 14.09,6.1 | 14.09,6.1 C4.A 14.73,4.7 14.73,2.79 14.99,2.54 C1.2
5V0  (via drill 0.38)
  Top 0.406: v12.06,46.86 15.88,46.86 16.19,47.18 U5.2 17.58,48.43 C6.1 | v9.65,54.99 9.65,56.64 10.16,57.15 R12.2
  Bottom 0.406: v12.06,46.86 12.06,54.1 11.3,54.86 9.78,54.86 v9.65,54.99
ANT
  Top 0.305: U1.9 72.15,29.2 | J4.SIG 73.64,29.2 72.15,29.2 | 72.15,29.2 J2.3
CARD_DETECT_0  (via drill 0.38)
  Top 0.305: JP1.SW 42.53,4.33 42.04,4.83 42.04,14.48 41.15,15.37 v41.15,16 | U3.23 38.29,33.08 v37.08,31.88
  Bottom 0.305: v37.08,31.88 40.89,28.07 40.89,16.26 v41.15,16
CARD_DETECT_1  (via drill 0.38)
  Top 0.305: JP2.SW 27.94,4.7 27.3,5.33 27.3,8.64 28.96,10.29 28.96,20.19 29.34,20.57 v29.34,23.37 | v36.58,35.94 37.08,35.94 37.47,36.32 37.47,37.73 U3.24
  Bottom 0.305: v29.34,23.37 29.46,23.37 35.69,29.59 35.69,35.05 v36.58,35.94
GND  (via drill 0.38)
  Top 0.305: SJ1.1 SJ3.1 SJ2.1
  other vias: 63.5,20.32 41.91,21.59 36.7,20.7 33.78,22.61 8.89,11.43 60.45,24.77 56.77,24.13 58.04,15.24 42.93,25.65 18.41,52.07 34.04,30.73 20.19,59.69 22.73,49.53 20.95,44.45 39.12,39.62
  pour Bottom: 0,0 76.2,0 76.2,76.2 0,76.2
  pour Top (isolate 0.305, rank 6): 0,0 76.2,0 76.2,76.2 0,76.2
MISO  (via drill 0.38)
  Top 0.305: U3.2 31.09,22 32.77,20.32 v32.77,18.92 | v36.32,15.37 36.32,17.03 JP2.7_DAT0 36.42,18.39 36.83,18.8 41.15,18.8 41.4,18.54 v44.83,18.54 | v53.09,18.92 53.09,17.29 JP1.7_DAT0 52.96,17.1 52.96,13.97 56.13,10.79 62.23,10.79 TC1.P$1 | SJ4.1 47.37,41.15 v45.59,39.37
  Bottom 0.305: v45.59,39.37 45.59,35.31 49.53,31.37 49.53,20.19 49.15,19.81 48.26,19.81 47.37,18.92 47.37,17.91 | v44.83,18.54 46.48,18.54 47.12,17.91 47.37,17.91 | 47.37,17.91 52.07,17.91 v53.09,18.92 | v32.77,18.92 32.77,18.16 35.56,15.37 v36.32,15.37
MOSI  (via drill 0.38)
  Top 0.305: v48.51,15.11 48.51,17.11 JP1.3_CMD 48.51,17.15 48.51,18.92 v48.64,19.05 | SJ5.1 47.12,39.12 v46.35,38.35 | TC1.P$4 65.02,10.16 v65.28,9.91 | U3.1 30.29,21.4 32,19.68 32,17.15 JP2.3_CMD 32.02,14.34 33.66,12.7 v35.43,12.7
  Bottom 0.305: v35.43,12.7 36.7,12.7 37.97,11.43 49.15,11.43 | v46.35,38.35 46.35,35.56 50.16,31.75 50.16,19.56 49.66,19.05 v48.64,19.05 | v65.28,9.91 64.64,9.27 52.7,9.27 50.55,11.43 49.15,11.43 | v48.51,15.11 49.15,14.48 49.15,11.43
N$1
  Top 0.61: Q1.3 10.53,32.02 6.99,35.56 J3.GND
N$2  (via drill 0.38)
  Top 0.305: U3.16 39.15,30.95 v38.73,31.37 | R2.1 48.39,26.67 44.58,30.48 v44.58,30.73
  Bottom 0.305: v44.58,30.73 39.37,30.73 v38.73,31.37
N$3
  Top 0.305: Y1.3 35.12,25.72 U3.7
N$4
  Top 0.305: R9.2 D4.ANODE
N$5
  Top 0.305: Y1.1 37.52,24.2 37.21,24.51 36.2,24.51 35.89,24.82 U3.8
N$6
  Top 0.254: U6.7 17.78,33.27 17.91,33.4 18.29,33.4 18.41,33.53 18.73,33.53 L1.P$1
N$7
  Top 0.305: U1.2 50.15,41.2 SJ4.2
N$8
  Top 0.305: R2.2 D1.ANODE
N$9
  Top 0.305: U1.3 50.19,39.2 SJ5.2
N$10  (via drill 0.38)
  Top 0.305: U4.6 59.18,20.95 58.67,21.46 58.67,31.88 v63.88,37.08
  Bottom 0.305: BAT1.PWR@1 67.18,35.56 64.83,37.91 | 64.83,37.91 64.26,38.48 56.2,38.48 BAT1.PWR@2 | v63.88,37.08 64.01,37.08 64.83,37.91
N$11
  Top 0.305: J1.2 6.93,13.39 7.86,12.46 U2.16
N$12
  Top 0.305: J1.3 6.69,12.74 7.21,12.23 U2.15
N$13
  Top 0.406: D6.ANODE 13.45,55.36 13.97,55.88 R13.1
N$14  (via drill 0.38)
  Top 0.254: U6.8 17.65,33.96
  Top 0.305: R5.1 16.98,29.76 v17.53,29.21 | v17.65,34.67 17.65,33.96
  Bottom 0.305: v17.53,29.21 17.53,34.54 v17.65,34.67
N$15
  Top 0.305: U1.4 50.22,37.2 SJ6.2
N$20
  Top 0.305: R10.2 D5.ANODE
N$23
  Top 0.305: U2.17 8.51,6.76 C2.1 | Q2.2 Q2.1
  Top 0.406: R8.1 9.69,3.65 Q2.2 | Q2.1 7.72,5.98 C2.1
N$29
  Top 0.305: C3.2 17.4,16.51 16.13,15.24 15.24,15.24 15.01,15.47 U2.2
N$30
  Top 0.305: D2.CATHODE 17.78,11.43 17.65,11.56 13.46,11.56 12.4,10.5 U2.23
N$31
  Top 0.305: U2.22 11.76,10.74 13.21,12.19 17.4,12.19 17.78,12.57 D3.CATHODE
N$32
  Top 0.305: D3.ANODE 20.27,14.72 R7.2
N$33
  Top 0.305: D2.ANODE 20.27,9.41 R6.2
NET_SEL_1
  Top 0.305: U3.25 36.69,38.98 38.48,40.77 40.13,40.77 40.64,41.27 SJ3.2
NET_SEL_2
  Top 0.305: U3.26 35.89,39.06 38.1,41.27 SJ2.2 37.97,41.33
NET_SEL_4  (1 unrouted)
  Top 0.305: 40.35,35.81 40.35,39.34 41.4,40.39 42.67,40.39 43.18,40.89 SJ1.2
RAIN_INT
  Top 0.305: U3.11 38.29,26.99 38.48,27.18 38.48,27.81 37.08,29.21 31.5,29.21 29.08,26.8 27.3,26.8 22.23,31.88 22.23,41.78 20.83,43.18 13.17,43.18 | 13.17,43.18 J11.P$2 | C11.1 13.17,43.18
RF_CS
  Top 0.305: 52.36,35.05 U1.5 52.24,34.92 40.31,34.92 U3.21
RF_INT  (via drill 0.38)
  Top 0.305: U1.14 67.46,39.24 60.33,39.24 55.24,34.16 45.47,34.16 v45.34,34.04 | U3.42 29.22,29.35 29.46,29.59 29.46,31.24 30.1,31.88 31.75,31.88 33.4,33.53 v36.83,33.53
  Bottom 0.305: v45.34,34.04 37.72,34.04 37.21,33.53 v36.83,33.53
RST  (via drill 0.38)
  Top 0.305: U3.4 32.69,22.3 33.78,21.21 v34.16,21.21 | v24.26,16.51 C3.1 19.81,16.55 19.81,21.46 | SW1.P$2 SW1.P$1 19.49,21.79 19.81,21.46 | v38.61,12.19 38.61,15.11 v38.35,15.37 | TC1.P$5 62.23,9.53 55.5,9.53 52.83,12.19 v48.26,12.19 | R1.2 21.21,22.86 19.81,21.46
  Bottom 0.305: v24.26,16.51 27.3,16.51 32,21.21 v34.16,21.21 34.16,17.65 35.31,16.51 37.21,16.51 v38.35,15.37 | v38.61,12.19 v48.26,12.19
RX0  (via drill 0.38)
  Top 0.305: U2.5 13.05,18.14 v13.97,19.05 | v37.47,27.56 37.47,25.77 U3.10
  Bottom 0.305: v13.97,19.05 28.96,19.05 v37.47,27.56
SCK  (via drill 0.38)
  Top 0.305: 50.8,17.14 50.8,17.2 | 50.8,17.2 JP1.5_CLK 50.73,14.66 49.53,13.46 49.53,12.95 | TC1.P$3 55.87,10.16 53.07,12.95 49.53,12.95 | JP2.5_CLK 34.22,19.3 | 34.22,19.3 34.22,20.01 31.89,22.34 U3.3 | v41.78,19.3 41.66,19.43 34.35,19.43 34.22,19.3 | SJ6.1 47.62,37.08 47.24,36.7 v47.24,35.81 | v47.5,12.95 49.53,12.95 | 50.8,17.2 50.8,18.67 v50.93,18.8
  Bottom 0.305: v41.78,19.3 41.78,16.64 41.91,16.51 41.91,13.72 42.67,12.95 v47.5,12.95 | v47.24,35.81 47.24,35.56 50.8,32 50.8,18.92 v50.93,18.8
SCL
  Top 0.305: U3.19 42.72,33.35 43.18,32.89 43.18,30.1 48.13,25.15 52.2,25.15 58.93,18.41 | U4.8 58.93,18.41 | R3.1 60.83,16.51 58.93,18.41
SD0_CS
  Top 0.305: U3.13 41.3,28.55 41.4,28.45 41.4,25.15 47.5,19.05 47.5,17.2 JP1.2_CD/DAT3
SD1_CS  (via drill 0.38)
  Top 0.305: v39.24,21.59 39.24,21.97 39.12,29.08 39.37,29.34 40.28,29.34 U3.14 | JP2.2_CD/DAT3 30.92,15.3 v30.73,15.11
  Bottom 0.305: v39.24,21.59 39.62,21.21 39.62,15.24 38.86,14.48 34.92,14.48 34.29,15.11 v30.73,15.11
SD_LED_0  (via drill 0.38)
  Top 0.305: v37.85,29.97 38.86,29.97 38.99,30.1 40.24,30.1 U3.15 | R10.1 42.55,2.54 41.4,3.68 41.4,13.84 v40.77,14.48
  Bottom 0.305: v37.85,29.97 40.26,27.56 40.26,14.99 v40.77,14.48
SD_LED_1  (via drill 0.38)
  Top 0.305: U3.44 29.15,27.75 29.59,28.19 29.59,28.45 v29.72,28.57 | v28.19,20.83 28.19,10.54 26.54,8.89 26.54,3.3 27.3,2.54 R9.1
  Bottom 0.305: v28.19,20.83 27.81,21.21 27.81,27.69 28.7,28.57 v29.72,28.57
SDA
  Top 0.305: R4.1 62.48,23.91 62.48,20.19 61.98,19.68 U4.7 58.42,19.68 52.32,25.78 48.39,25.78 43.81,30.35 43.81,33.27 42.93,34.16 40.3,34.16 U3.20
SDI_12V  (via drill 0.38)
  Top 0.305: J10.P$1 J9.P$1 J8.P$1 | J7.P$1 J6.P$1 J5.P$1
  Top 0.406: v12.95,53.09 12.95,52.83 13.35,52.44 Q3.2 14.1,52.3 14.1,50.55 | 14.1,50.55 15.16,50.55 U5.3 | 12.58,50.55 14.1,50.55 | J5.P$1 9.78,49.53 10.79,50.55 12.58,50.55 | 12.58,50.55 C5.1
  Bottom 0.406: v12.95,53.09 12.95,60.83 11.56,62.23 J8.P$1
SDI_DATA_3V3  (via drill 0.38)
  Top 0.305: U3.43 26.7,28.55 v26.16,29.08 | v25.91,33.27 25.91,48.26 26.8,49.15 v26.8,53.59 | R11.1 15.88,62.23 16.26,61.85 16.26,61.34 | 16.26,61.34 16.26,60.61 Q4.2 | 16.26,61.34 24.13,61.34 26.8,58.67 v26.8,56.01
  Bottom 0.305: v26.16,29.08 26.16,33.02 v25.91,33.27 | v26.8,53.59 v26.8,56.01
SDI_DATA_5V0
  Top 0.305: J10.P$2 J9.P$2 J8.P$2 13.08,59.69 13.34,59.44 | J7.P$2 J6.P$2 J5.P$2 | Q4.3 13.46,59.69 13.34,59.56 13.34,59.44 | 13.34,59.44 13.34,57.31 R12.1
  Bottom 0.305: J5.P$2 6.99,52.07 6.35,52.7 6.35,59.05 6.99,59.69 J8.P$2
SDI_EN  (via drill 0.38)
  Top 0.305: U3.41 26.11,30.15 22.86,33.4 22.86,46.99 25.4,49.53 25.4,52.58 25.15,52.83 v24.89,52.83 | 14.36,54.36 Q3.1 14.25,54.23 17.65,54.23 19.05,52.83 v20.57,52.83
  Bottom 0.305: v24.89,52.83 v20.57,52.83
SDI_LED  (via drill 0.38)
  Top 0.305: U3.40 26.2,30.95 23.62,33.53 23.62,46.74 26.16,49.28 26.16,52.83 25.15,53.85 24.51,53.85 v24.26,53.59 | 17.65,55.88 R13.2 18.41,55.88 20.19,54.1 v20.45,54.1
  Bottom 0.305: v24.26,53.59 20.95,53.59 v20.45,54.1
TX0  (via drill 0.38)
  Top 0.305: U3.9 36.69,27.45 v36.32,27.81 | v16.26,19.94 15.65,19.34 U2.1
  Bottom 0.305: v36.32,27.81 36.32,27.3 28.7,19.68 16.51,19.68 v16.26,19.94
V_BAT  (via drill 0.38)
  Top 0.254: 15.37,33.02 U6.3 U6.2
  Top 0.305: Q1.1 13.6,34.29
  Top 0.61: J3.PWR 12.95,30.48 13.6,31.13 Q1.1 13.59,33.02 15.37,33.02 | 13.6,34.29 13.6,35.43 | 13.6,35.43 13.6,35.7 13.84,35.94 15.23,35.94 C7.1 | Q3.3 17.02,53.34 17.14,53.21 17.14,52.2 v16.89,51.94 | v14.22,41.91 14.22,41.78 13.59,41.15 13.59,35.44 13.6,35.43
  Bottom 0.61: v16.89,51.94 16.76,51.94 14.22,49.4 v14.22,41.91

### Text on the board
tPlace: OFF | ON | 1 | 2 | 4 | 7-16v | RESET | SD1 | SD2
tNames: datalogger-v11 | 2016-10-13